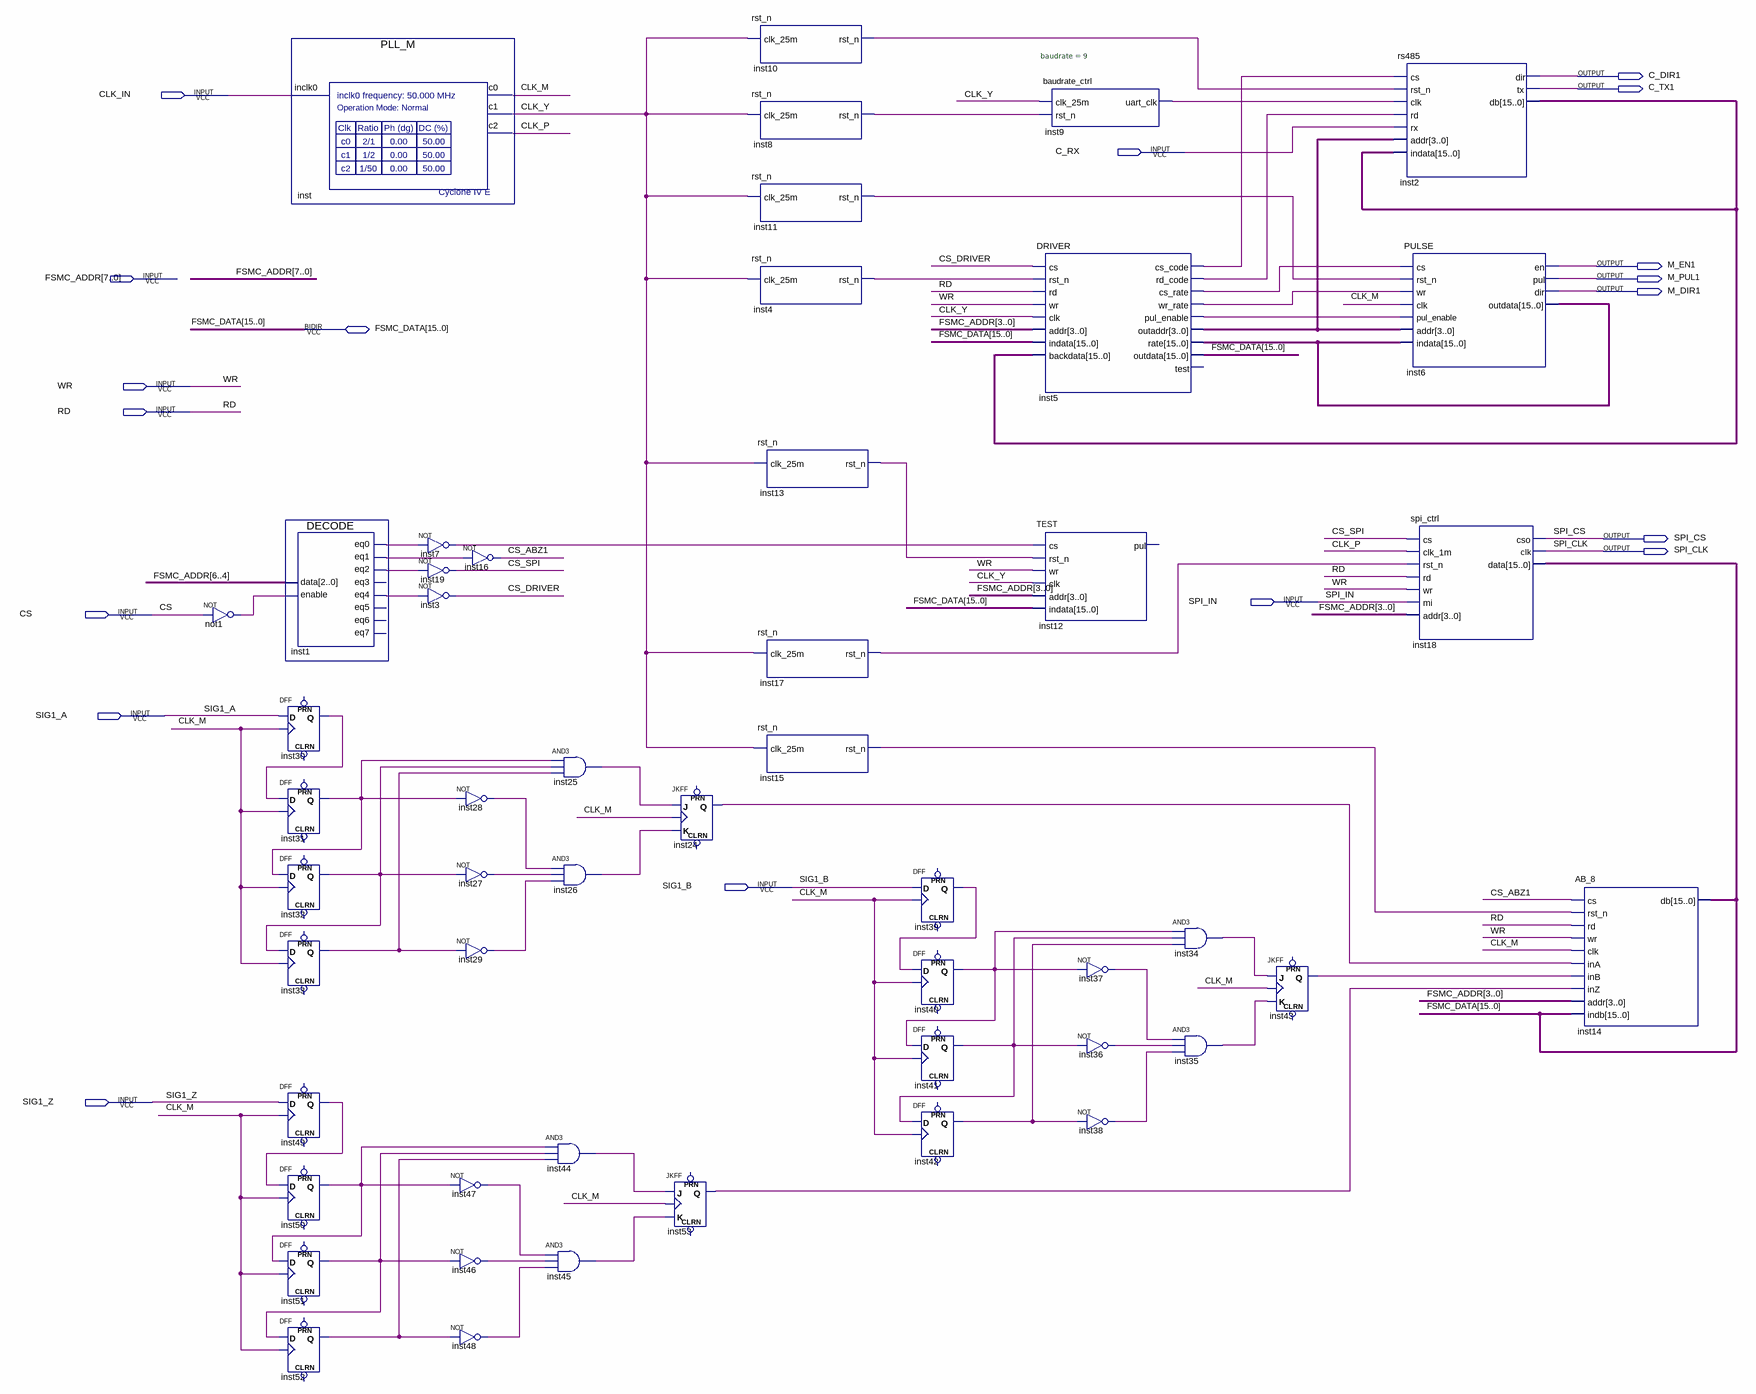
[diagram p0: schematic sheet]
// Quartus schematic SEA1.bdf as structural Verilog: 51 symbols, 18 pins
module SEA1 (
  input  CLK_IN,
  input  C_RX,
  input  [7:0] FSMC_ADDR,
  input  WR,
  input  RD,
  input  SPI_IN,
  input  CS,
  input  SIG1_A,
  input  SIG1_B,
  input  SIG1_Z,
  inout  [15:0] FSMC_DATA,
  output C_DIR1,
  output C_TX1,
  output M_EN1,
  output M_PUL1,
  output M_DIR1,
  output SPI_CS,
  output SPI_CLK
);

  wire CLK_M, CLK_P, CLK_Y, CS_ABZ1, CS_DRIVER, CS_SPI, inst1_eq0, inst1_eq1, inst1_eq2, inst1_eq4,
       inst4_rst_n, inst5_cs_code, inst5_cs_rate, inst5_pul_enable, inst5_rd_code, inst5_wr_rate, inst7_out,
       inst8_rst_n, inst9_uart_clk, inst10_rst_n, inst11_rst_n, inst13_rst_n, inst15_rst_n, inst17_rst_n,
       inst24_q, inst25_out, inst26_out, inst27_out, inst28_out, inst29_out, inst30_q, inst31_q, inst32_q,
       inst33_q, inst34_out, inst35_out, inst36_out, inst37_out, inst38_out, inst39_q, inst40_q, inst41_q,
       inst42_q, inst43_q, inst44_out, inst45_out, inst46_out, inst47_out, inst48_out, inst49_q, inst50_q,
       inst51_q, inst52_q, inst53_q, not1_out;
  wire [3:0] inst5_outaddr;
  wire [15:0] inst2_db, inst5_rate;

  not not1 (not1_out, CS);
  PLL_M inst (.inclk0(CLK_IN), .c0(CLK_M), .c1(CLK_Y), .c2(CLK_P));
  DECODE inst1 (
    .data(FSMC_ADDR[6:4]), .enable(not1_out), .eq0(inst1_eq0), .eq1(inst1_eq1), .eq2(inst1_eq2),
    .eq4(inst1_eq4));  // open: eq3, eq5, eq6, eq7
  DFF inst30 (.CLK(CLK_M), .D(SIG1_A), .Q(inst30_q));  // open: CLRN, PRN
  DFF inst31 (.CLK(CLK_M), .D(inst30_q), .Q(inst31_q));  // open: CLRN, PRN
  DFF inst32 (.CLK(CLK_M), .D(inst31_q), .Q(inst32_q));  // open: CLRN, PRN
  DFF inst33 (.CLK(CLK_M), .D(inst32_q), .Q(inst33_q));  // open: CLRN, PRN
  DFF inst49 (.CLK(CLK_M), .D(SIG1_Z), .Q(inst49_q));  // open: CLRN, PRN
  DFF inst50 (.CLK(CLK_M), .D(inst49_q), .Q(inst50_q));  // open: CLRN, PRN
  DFF inst51 (.CLK(CLK_M), .D(inst50_q), .Q(inst51_q));  // open: CLRN, PRN
  DFF inst52 (.CLK(CLK_M), .D(inst51_q), .Q(inst52_q));  // open: CLRN, PRN
  not inst7 (inst7_out, inst1_eq0);
  not inst19 (CS_SPI, inst1_eq2);
  not inst3 (CS_DRIVER, inst1_eq4);
  not inst47 (inst47_out, inst50_q);
  not inst46 (inst46_out, inst51_q);
  not inst48 (inst48_out, inst52_q);
  not inst16 (CS_ABZ1, inst1_eq1);
  not inst28 (inst28_out, inst31_q);
  not inst27 (inst27_out, inst32_q);
  not inst29 (inst29_out, inst33_q);
  and inst25 (inst25_out, inst31_q, inst32_q, inst33_q);
  and inst26 (inst26_out, inst28_out, inst27_out, inst29_out);
  and inst44 (inst44_out, inst50_q, inst51_q, inst52_q);
  and inst45 (inst45_out, inst47_out, inst46_out, inst48_out);
  JKFF inst24 (.K(inst26_out), .J(inst25_out), .CLK(CLK_M), .Q(inst24_q));  // open: PRN, CLRN
  JKFF inst53 (.K(inst45_out), .J(inst44_out), .CLK(CLK_M), .Q(inst53_q));  // open: PRN, CLRN
  rst_n inst10 (.clk_25m(CLK_Y), .rst_n(inst10_rst_n));
  rst_n inst8 (.clk_25m(CLK_Y), .rst_n(inst8_rst_n));
  rst_n inst11 (.clk_25m(CLK_Y), .rst_n(inst11_rst_n));
  rst_n inst4 (.clk_25m(CLK_Y), .rst_n(inst4_rst_n));
  rst_n inst13 (.clk_25m(CLK_Y), .rst_n(inst13_rst_n));
  rst_n inst17 (.clk_25m(CLK_Y), .rst_n(inst17_rst_n));
  rst_n inst15 (.clk_25m(CLK_Y), .rst_n(inst15_rst_n));
  DFF inst39 (.CLK(CLK_M), .D(SIG1_B), .Q(inst39_q));  // open: CLRN, PRN
  DFF inst40 (.CLK(CLK_M), .D(inst39_q), .Q(inst40_q));  // open: CLRN, PRN
  DFF inst41 (.CLK(CLK_M), .D(inst40_q), .Q(inst41_q));  // open: CLRN, PRN
  DFF inst42 (.CLK(CLK_M), .D(inst41_q), .Q(inst42_q));  // open: CLRN, PRN
  baudrate_ctrl #(.baudrate(9)) inst9 (.clk_25m(CLK_Y), .rst_n(inst8_rst_n), .uart_clk(inst9_uart_clk));
  DRIVER inst5 (
    .cs(CS_DRIVER), .rst_n(inst4_rst_n), .rd(RD), .wr(WR), .clk(CLK_Y), .addr(FSMC_ADDR[3:0]),
    .indata(FSMC_DATA), .backdata(inst2_db), .cs_code(inst5_cs_code), .rd_code(inst5_rd_code),
    .cs_rate(inst5_cs_rate), .wr_rate(inst5_wr_rate), .pul_enable(inst5_pul_enable), .outaddr(inst5_outaddr),
    .rate(inst5_rate), .outdata(FSMC_DATA));  // open: test
  TEST inst12 (
    .cs(inst7_out), .rst_n(inst13_rst_n), .wr(WR), .clk(CLK_Y), .addr(FSMC_ADDR[3:0]), .indata(FSMC_DATA));  // open: pul
  not inst37 (inst37_out, inst40_q);
  not inst36 (inst36_out, inst41_q);
  not inst38 (inst38_out, inst42_q);
  and inst34 (inst34_out, inst40_q, inst41_q, inst42_q);
  and inst35 (inst35_out, inst37_out, inst36_out, inst38_out);
  JKFF inst43 (.K(inst35_out), .J(inst34_out), .CLK(CLK_M), .Q(inst43_q));  // open: PRN, CLRN
  rs485 inst2 (
    .cs(inst5_cs_code), .rst_n(inst10_rst_n), .clk(inst9_uart_clk), .rd(inst5_rd_code), .rx(C_RX),
    .addr(inst5_outaddr), .indata(inst2_db), .dir(C_DIR1), .tx(C_TX1), .db(inst2_db));
  PULSE inst6 (
    .cs(inst5_cs_rate), .rst_n(inst11_rst_n), .wr(inst5_wr_rate), .clk(CLK_M), .pul_enable(inst5_pul_enable),
    .addr(inst5_outaddr), .indata(inst5_rate), .en(M_EN1), .pul(M_PUL1), .dir(M_DIR1), .outdata(inst5_rate));
  spi_ctrl inst18 (
    .cs(CS_SPI), .clk_1m(CLK_P), .rst_n(inst17_rst_n), .rd(RD), .wr(WR), .mi(SPI_IN), .addr(FSMC_ADDR[3:0]),
    .cso(SPI_CS), .clk(SPI_CLK), .data(FSMC_DATA));
  AB_8 inst14 (
    .cs(CS_ABZ1), .rst_n(inst15_rst_n), .rd(RD), .wr(WR), .clk(CLK_M), .inA(inst24_q), .inB(inst43_q),
    .inZ(inst53_q), .addr(FSMC_ADDR[3:0]), .indb(FSMC_DATA), .db(FSMC_DATA));
endmodule
